# EasyEDA Pro project 一体板.epro, schematic Schematic1
Create Date: 2023-07-03; Page Name: P1; Project Name: 独轮车七月v2; Schematic Name: Schematic1; Update Date: 2023-07-09; Company: 嘉立创EDA; Page Size: A4; Version: V1.0
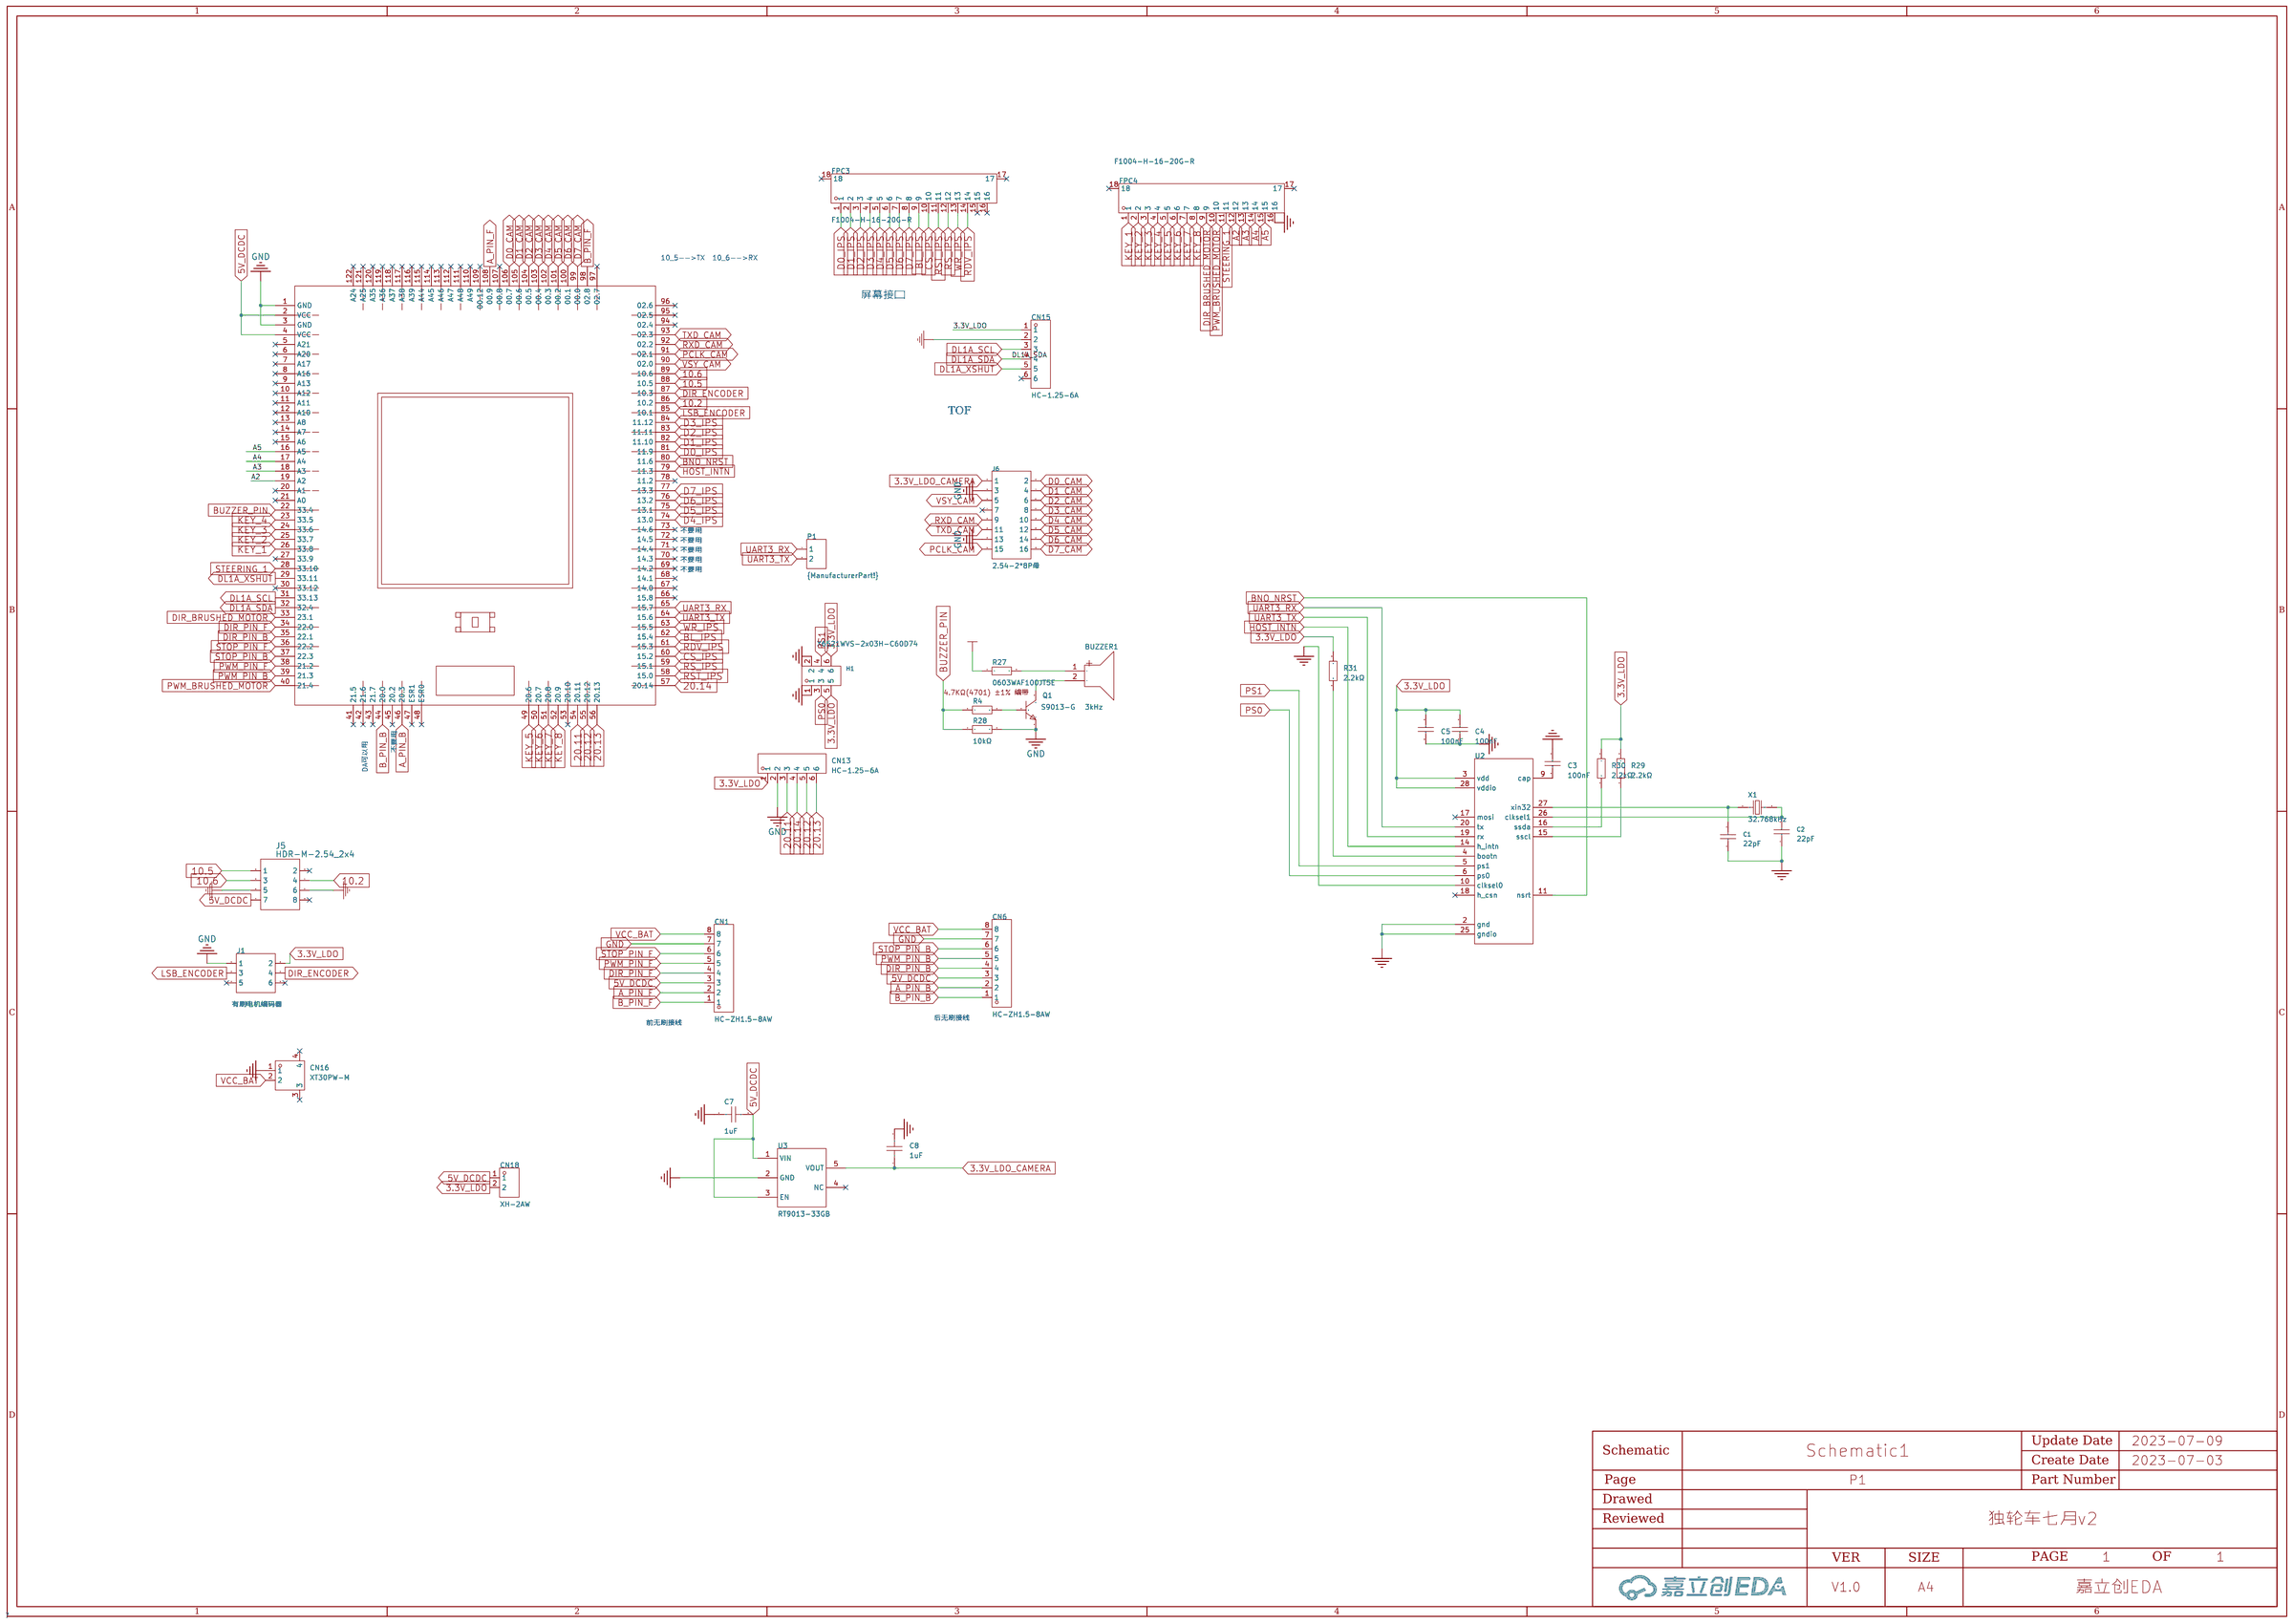
[diagram p0: schematic sheet]

## Parts
BUZZER1  3kHz  [BUZ-TH_BD9.0-P5.00-D0.6-FD]
C1  22pF  [C0402]
C2  22pF  [C0402]
C3  100nF  [C0603]
C4  100nF  [C0603]
C5  100nF  [C0603]
C7  1uF  [C0603]
C8  1uF  [C0603]
CN1  HC-ZH1.5-8AW  [CONN-TH_8P-P1.50_HCTL_HC-ZH1.5-8AW]
CN6  HC-ZH1.5-8AW  [CONN-TH_8P-P1.50_HCTL_HC-ZH1.5-8AW]
CN13  HC-1.25-6A  [CONN-TH_6P-P1.25_HCTL_HC-1.25-6A]
CN15  HC-1.25-6A  [CONN-TH_6P-P1.25_HCTL_HC-1.25-6A]
CN16  XT30PW-M  [CONN-TH_XT30PW-M]
CN18  XH-2AW  [CONN-TH_XH-2AW_C2908611]
FPC3  F1004-H-16-20G-R  [CONN-SMD_F1004-H-16-20G-R]
FPC4  F1004-H-16-20G-R  [CONN-SMD_F1004-H-16-20G-R]
H1  X6521WVS-2x03H-C60D74  [HDR-SMD_6P-P2.54-V-M-R2-C5-S7.4]
J1  有刷电机编码器  [HDR-TH_6P-P2.54-V-M-R2-C3-S2.54-1]
J5  HDR-M-2.54_2x4  [HDR-M-2.54_2X4]
J6  2.54-2*8P母  [HDR-TH_16P-P2.54-V-F-R2-C8-S2.54-1]
P1  -  [HDR-TH_2P-P2.54-V-F]
Q1  S9013-G  [SOT-23-3_L2.9-W1.3-P1.90-LS2.4-BR]
R4  0603WAF4701T5E  [R0603]
R27  0603WAF100JT5E  [R0603]
R28  10kΩ  [R0603]
R29  2.2kΩ  [R0603]
R30  2.2kΩ  [R0603]
R31  2.2kΩ  [R0603]
U1  TC387核心板 COPY  [TC264逐飞]
U2  -  [lga_28]
U3  RT9013-33GB  [SOT-23-5_L3.0-W1.7-P0.95-LS2.8-BL]
X1  32.768kHz  [FC-135R_L3.2-W1.5]

## Library data of the parts
BUZZER1 = HNB09A03: 驱动方式:电磁式;构造类型:有源;额定电压:3V;工作电压:1.5V~4.5V;消耗电流:30mA;频率:3kHz;声压(SPL):85dB@10cm;直径(φD):9mm;长度:-;宽度:-;高度:5.5mm;工作温度:-20~+70;; LCSC Part Name: 电磁式有源一体蜂鸣器HNB09A03; Supplier Part: C96102; Manufacturer: 华能; Supplier Footprint: 插件,P=5mm; JLCPCB Part Class: ExtendedPart; Datasheet: https://atta.szlcsc.com/upload/public/pdf/source/20170522/1495448326172.pdf; Supplier: LCSC; Oscillator Circuit: 电磁式; Technology Type: 有源; Rated Voltage: 3V; Operating Voltage: 1.5V~4.5V; Current Consumption: 30mA; Sound Pressure Level (SPL): 85dB@10cm; Diameter (φD): 9mm; Height: 5.5mm; Operating Temperature: -20~+70
C1 C2 = 0402CG220J500NT: 容值:22pF;精度:±5%;额定电压:50V;材质(温度系数):C0G;; LCSC Part Name: 22pF±5%50V; Supplier Part: C1555; Manufacturer: FH(风华); Supplier Footprint: 0402; JLCPCB Part Class: BasicPart; Datasheet: https://atta.szlcsc.com/upload/public/pdf/source/20200305/C486355_26A10D38EF8C2A5C37091D0039909270.pdf; Supplier: LCSC; Tolerance: ±5%; Voltage Rated: 50V; Temperature Coefficient: C0G
C3-C5 = 0603B104K500NT: 容值:100nF;精度:±10%;额定电压:50V;材质(温度系数):X7R;; LCSC Part Name: 100nF±10%50V; Supplier Part: C30926; Manufacturer: FH(风华); Supplier Footprint: 0603; JLCPCB Part Class: 扩展库; Datasheet: https://atta.szlcsc.com/upload/public/pdf/source/20170923/C30926_1506149436298988724.pdf; Supplier: LCSC; Tolerance: ±10%; Voltage Rated: 50V; Temperature Coefficient: X7R
C7 C8 = 0603B105K500NT: 温度系数:X7R;精度:±10%;额定电压:50V;容值:1uF;; LCSC Part Name: 1uF(105) ±10% 50V; Supplier Part: C90540; Manufacturer: FH(风华); Supplier Footprint: 0603; JLCPCB Part Class: Extended Part; Datasheet: https://atta.szlcsc.com/upload/public/pdf/source/20170923/C90540_1506149560830988967.pdf; Supplier: LCSC; Temperature Coefficient: X7R; Tolerance: ±10%; Voltage Rated: 50V
CN1 CN6 = HC-ZH1.5-8AW: 参考系列:ZH;间距:1.5mm;插针结构:1x8P;排数:1;每排PIN数:8;行距:-;公母:公型插针;安装方式:弯插;额定电流:1A;工作温度范围:-25~+85;; LCSC Part Name: 8P间距P=1.5mm; Supplier Part: C2845571; Manufacturer: HCTL(华灿天禄); Supplier Footprint: 插件,P=1.5mm; JLCPCB Part Class: ExtendedPart; Datasheet: https://atta.szlcsc.com/upload/public/pdf/source/20211122/624702E7E83328BF37B6C704FA01E49F.pdf; Supplier: LCSC; Reference Series: ZH; Pitch: 1.5mm; Pins Structure: 1x8P; Number of Rows: 1; Number of PINs Per Row: 8; Gender: 公型插针; Mounting Style: 弯插; Current Rating (Max): 1A; Operating Temperature Range: -25~+85
CN13 CN15 = HC-1.25-6A: 参考系列:-;间距:1.25mm;插针结构:1x6P;排数:1;每排PIN数:6;行距:-;公母:公型插针;安装方式:直插;额定电流:1A;工作温度范围:-25℃~+85℃;; LCSC Part Name: 1.25mm1x6P直插; Supplier Part: C2845524; Manufacturer: HCTL(华灿天禄); Supplier Footprint: 插件,P=1.25mm; JLCPCB Part Class: ExtendedPart; Datasheet: https://atta.szlcsc.com/upload/public/pdf/source/20210729/C2845520_89EAA22C8D4DE2FB8A253230326912FB.pdf; Supplier: LCSC; Pitch: 1.25mm; Pins Structure: 1x6P; Number of Rows: 1; Number of PINs Per Row: 6; Gender: 公型插针; Mounting Style: 直插; Current Rating (Max): 1A; Operating Temperature Range: -25℃~+85℃
CN16 = XT30PW-M: Socket,DCsupply,XT30,male,PIN:2; LCSC Part Name: AMASS(艾迈斯)航模插头卧式弯脚XT30PW-M公头; Supplier Part: C431092; Manufacturer: AMASS(艾迈斯); JLCPCB Part Class: ExtendedPart; Datasheet: https://atta.szlcsc.com/upload/public/pdf/source/20220222/6A9F22F7850E25B33E1BE430ADF8560B.pdf; Supplier: LCSC
CN18 = XH-2AW_C2908611: 参考系列:XH;间距:2.54mm;插针结构:1x2P;排数:1;每排PIN数:2;行距:-;公母:公型插针;安装方式:弯插;额定电流:3A;工作温度范围:-25℃~+85℃;; LCSC Part Name: XH2.54mm1x2P弯插; Supplier Part: C2908611; Manufacturer: HCTL(华灿天禄); Supplier Footprint: 弯插,P=2.54mm; JLCPCB Part Class: ExtendedPart; Datasheet: https://atta.szlcsc.com/upload/public/pdf/source/20211021/ACA2D54D99493880102FCACAC8DAABA8.pdf; Supplier: LCSC; Reference Series: XH; Pitch: 2.54mm; Pins Structure: 1x2P; Number of Rows: 1; Number of PINs Per Row: 2; Gender: 公型插针; Mounting Style: 弯插; Current Rating (Max): 3A; Operating Temperature Range: -25℃~+85℃
FPC3 FPC4 = F1004-H-16-20G-R: 间距:1mm;触点数量:16P;锁定特性:翻盖式;安装类型:卧贴;触点类型:双侧触点/上下接;; LCSC Part Name: 1mmP数:16P翻盖式双侧触点/上下接; Supplier Part: C668118; Manufacturer: XFCN(兴飞); Supplier Footprint: SMD,P=1mm; JLCPCB Part Class: ExtendedPart; Datasheet: https://atta.szlcsc.com/upload/public/pdf/source/20200618/C668118_823AC902B97FF0E52163AB5BF80076C2.pdf; Supplier: LCSC; Pitch: 1mm; Number of Contacts: 16P; Locking Feature: 翻盖式; Mounting Type: 卧贴; Contact Type: 双侧触点/上下接; Height Above Board: 2mm; FFC, FCB Thickness: 0.3mm
H1 = X6521WVS-2x03H-C60D74: 排数:双排;总PIN位数:6P;间距:2.54mm;插针结构:2x3P;行距:2.54mm;安装类型:立贴;圆针/方针:方针;额定电流:3A;额定电压:250V;配合针长度:6mm;塑高:2.5mm;端接针长度:-;触头材质:黄铜;触头镀层:金;工作温度范围:-40℃~+105℃;焊接温度(最大值):260℃;颜色:黑色;; LCSC Part Name: 2.54mm 2x3P 立贴 方针; Supplier Part: C780054; Manufacturer: XKB Connectivity(中国星坤); Supplier Footprint: SMD,P=2.54mm; JLCPCB Part Class: Extended Part; Datasheet: https://atta.szlcsc.com/upload/public/pdf/source/20211009/E3239EE5247E6BAFECB8B74A4FCF9AB8.pdf; Supplier: LCSC; Number of Rows: 双排; Number of Pins: 6P; Pitch: 2.54mm; Pin Structure: 2x3P; Row Spacing: 2.54mm; Mounting Type: 立贴; Circluar Pins/Square Pins: 方针; Current Rating (Max): 3A; Voltage Rating (Max): 250V; Length of Mating Pin: 6mm; Insulation Height: 2.5mm; Contact Material: 黄铜; Contact Plating: 金; Operating Temperature Range: -40℃~+105℃; Welding Temperature (Max): 260℃; Color: 黑色
J1 = 2.54-2*3P针: 间距:2.54mm;总PIN位数:6;排数:2;插针结构:-;行距:-;安装类型:直插;圆针/方针:-;额定电流:-;额定电压:-;配合针长度:-;塑高:-;触头材质:-;触头镀层:-;颜色:黑色;; LCSC Part Name: 2.54mm直插; Supplier Part: C65114; Manufacturer: BOOMELE(博穆精密); Supplier Footprint: 直插,P=2.54mm; JLCPCB Part Class: ExtendedPart; Datasheet: https://atta.szlcsc.comnull; Supplier: LCSC; Pitch: 2.54mm; Number of Pins: 6; Number of Rows: 2; Mounting Type: 直插; Color: 黑色
J5 = HDR-M-2.54_2x4: Supplier Part: C58363; Supplier: LCSC
J6 = 2.54-2*8P母: 排数:双排;总孔位数:16;间距:2.54mm;插孔结构:2x8P;行距:2.54mm;安装类型:直插;塑高:-;触头材质:黄铜;触头镀层:-;; LCSC Part Name: 2.54mm2x8P; Supplier Part: C30734; Manufacturer: BOOMELE(博穆精密); Supplier Footprint: 插件,P=2.54mm; JLCPCB Part Class: ExtendedPart; Supplier: LCSC; Number of Rows: 双排; Number of Holes: 16; Pitch: 2.54mm; Holes Structure: 2x8P; Row Spacing: 2.54mm; Mounting Type: 直插; Contact Material: 黄铜
P1 = 2.54-1*2P母: 间距:2.54mm;总孔位数:2;排数:1;插孔结构:1x2P;行距:-;安装类型:直插;塑高:-;触头材质:-;触头镀层:-;; LCSC Part Name: 2.54mm1x2P; Supplier Part: C49661; Manufacturer: BOOMELE(博穆精密); Supplier Footprint: 直插,P=2.54mm; JLCPCB Part Class: ExtendedPart; Datasheet: https://atta.szlcsc.com/upload/public/pdf/source/20151109/1457707570988.pdf; Supplier: LCSC; Pitch: 2.54mm; Number of Holes: 2; Number of Rows: 1; Holes Structure: 1x2P; Mounting Type: 直插
Q1 = S9013-G: 晶体管类型:NPN;集射极击穿电压(Vceo):25V;集电极电流(Ic):500mA;功率(Pd):300mW;; LCSC Part Name: S9013H档(200-350)H档(200-350); Supplier Part: C164888; Manufacturer: CJ(江苏长电/长晶); Supplier Footprint: SOT-23(SOT-23-3); JLCPCB Part Class: ExtendedPart; Datasheet: https://atta.szlcsc.com/upload/public/pdf/source/20171228/C164888_15144412896081213891.pdf; Supplier: LCSC; Transistor Type: NPN; Collector-Emitter Breakdown Voltage (Vceo): 25V; Collector Current (Ic): 500mA; Power Dissipation (Pd): 300mW
R4 = 0603WAF4701T5E: LCSC Part Name: 4.7KΩ(4701) ±1% 编带; Supplier Part: C23162; Manufacturer: UNI-ROYAL(厚声); Supplier Footprint: 0603; JLCPCB Part Class: BasicPart; Datasheet: https://atta.szlcsc.com/upload/public/pdf/source/20170920/C23162_1505901109673982545.pdf; Supplier: LCSC
R27 = 0603WAF100JT5E: LCSC Part Name: 10Ω(10R0)±1%编带; Supplier Part: C22859; Manufacturer: UNI-ROYAL(厚声); Supplier Footprint: 0603; JLCPCB Part Class: BasicPart; Datasheet: https://atta.szlcsc.com/upload/public/pdf/source/20170920/C22859_1505900954295982249.pdf; Supplier: LCSC
R28 = 0603WAF1002T5E: 电阻类型:厚膜电阻;阻值:10kΩ;精度:±1%;功率:100mW;温度系数:±100ppm/;最大工作电压:75V;工作温度范围:-55~+155;; LCSC Part Name: 10kΩ±1%100mW; Supplier Part: C25804; Manufacturer: UNI-ROYAL(厚声); Supplier Footprint: 0603; JLCPCB Part Class: BasicPart; Datasheet: https://atta.szlcsc.com/upload/public/pdf/source/20200306/C422600_1E6D84923E4A46A82E41ADD87F860B5C.pdf; Supplier: LCSC; Type: 厚膜电阻; Tolerance: ±1%; Power(Watts): 100mW; Temperature Coefficient: ±100ppm/; Overload Voltage (Max): 75V; Operating Temperature Range: -55~+155
R29-R31 = 0603WAF2201T5E: 电阻类型:厚膜电阻;阻值:2.2kΩ;精度:±1%;功率:100mW;; LCSC Part Name: 2.2kΩ±1%100mW; Supplier Part: C4190; Manufacturer: UNI-ROYAL(厚声); Supplier Footprint: 0603; JLCPCB Part Class: BasicPart; Datasheet: https://atta.szlcsc.com/upload/public/pdf/source/20200306/C422600_1E6D84923E4A46A82E41ADD87F860B5C.pdf; Supplier: LCSC; Type: 厚膜电阻; Tolerance: ±1%; Power(Watts): 100mW; Temperature Coefficient: ±100ppm/℃; Overload Voltage (Max): 75V; Operating Temperature Range: -55℃~+155℃
U1 = TC264核心板 COPY: Supplier: 逐飞
U2 = bno085: Supplier Part: C5189642
U3 = RT9013-33GB: 输出类型:固定;输出极性:正;最大输入电压:5.5V;输出电压:3.3V;输出电流:500mA;电源纹波抑制比(PSRR):50dB@(10kHz);; Supplier Part: C47773; Manufacturer: RICHTEK(立锜); Supplier Footprint: SOT-23-5; JLCPCB Part Class: Extended Part; Datasheet: https://atta.szlcsc.com/upload/public/pdf/source/20150504/1457707282459.pdf; Supplier: LCSC; Output Type: 固定; Output Polarity: 正; Number of Outputs: 1; Maximum Input Voltage: 5.5V; Output Voltage: 3.3V; Dropout Voltage: 400mV@(500mA); Output Current: 500mA; Power Supply Rejection Ratio (PSRR): 50dB@(10kHz)
X1 = Q13FC1350000400: 频率:32.768kHz;频率公差:±20ppm;负载电容:12.5pF;; LCSC Part Name: 32.768kHz±20ppm12.5pF; Supplier Part: C32346; Manufacturer: EPSON(爱普生); Supplier Footprint: SMD3215-2P; JLCPCB Part Class: BasicPart; Datasheet: https://atta.szlcsc.com/upload/public/pdf/source/20190108/C32346_746D6B07EAF90824457A96480007685F.pdf; Supplier: LCSC; Crystal Type: 贴片无源晶振; Frequency Tolerance: ±20ppm; Load Capacitance: 12.5pF; Equivalent Series Resistance (ESR): 70kΩ; Operating Temperature: -40℃~+85℃

## Nets
3.3V_LDO: C4.1 C5.1 CN13.1 CN15.1 CN18.2 H1.5 H1.6 J1.2 R27.1 R29.2 R30.2 R31.2 U2.3(vdd) U2.28(vddio)
3.3V_LDO_CAMERA: C8.1 J6.1 U3.5(VOUT)
5V_DCDC: C7.2 CN1.3 CN6.3 CN18.1 J5.7 U1.2(VCC) U1.4(VCC) U3.1(VIN) U3.3(EN)
GND: C1.1 C2.1 C3.1 C4.2 C5.2 C7.1 C8.2 CN1.7 CN6.7 CN13.2 CN15.2 CN16.1 FPC4.16 H1.1 H1.2 J1.1 J5.5 J5.6 J6.3 J6.13 Q1.2(E) R28.2 U1.1(GND) U1.3(GND) U2.2(gnd) U2.10(clksel0) U2.25(gndio) U3.2(GND)
VCC_BAT: CN1.8 CN6.8 CN16.2
10.2: J5.4 U1.86(10.2)
10.5: J5.1 U1.88(10.5)
10.6: J5.3 U1.89(10.6)
20.11: CN13.3 U1.54(20.11)
20.12: CN13.5 U1.55(20.12)
20.13: CN13.6 U1.56(20.13)
20.14: CN13.4 U1.57(20.14)
A2: FPC4.12 U1.19(A2)
A3: FPC4.13 U1.18(A3)
A4: FPC4.14 U1.17(A4)
A5: FPC4.15 U1.16(A5)
A_PIN_B: CN6.2 U1.46(20.3)
A_PIN_F: CN1.2 U1.108(00.9)
B_PIN_B: CN6.1 U1.44(20.0)
B_PIN_F: CN1.1 U1.98(02.8)
BL_IPS: FPC3.9 U1.62(15.4)
BNO_NRST: U1.80(11.6) U2.11(nsrt)
BUZZER_PIN: R4.1 R28.1 U1.22(33.4)
CS_IPS: FPC3.10 U1.60(15.2)
D0_CAM: J6.2 U1.106(00.7)
D0_IPS: FPC3.1 U1.81(11.9)
D1_CAM: J6.4 U1.105(00.6)
D1_IPS: FPC3.2 U1.82(11.10)
D2_CAM: J6.6 U1.104(00.5)
D2_IPS: FPC3.3 U1.83(11.11)
D3_CAM: J6.8 U1.103(00.4)
D3_IPS: FPC3.4 U1.84(11.12)
D4_CAM: J6.10 U1.102(00.3)
D4_IPS: FPC3.5 U1.74(13.0)
D5_CAM: J6.12 U1.101(00.2)
D5_IPS: FPC3.6 U1.75(13.1)
D6_CAM: J6.14 U1.100(00.1)
D6_IPS: FPC3.7 U1.76(13.2)
D7_CAM: J6.16 U1.99(00.0)
D7_IPS: FPC3.8 U1.77(13.3)
DIR_BRUSHED_MOTOR: FPC4.9 U1.33(23.1)
DIR_ENCODER: J1.4 U1.87(10.3)
DIR_PIN_B: CN6.4 U1.35(22.1)
DIR_PIN_F: CN1.4 U1.34(22.0)
DL1A_SCL: CN15.3 U1.31(33.13)
DL1A_SDA: CN15.4 U1.32(32.4)
DL1A_XSHUT: CN15.5 U1.29(33.11)
HOST_INTN: U1.79(11.3) U2.14(h_intn)
KEY_1: FPC4.1 U1.26(33.8)
KEY_2: FPC4.2 U1.25(33.7)
KEY_3: FPC4.3 U1.24(33.6)
KEY_4: FPC4.4 U1.23(33.5)
KEY_5: FPC4.5 U1.49(20.6)
KEY_6: FPC4.6 U1.50(20.7)
KEY_7: FPC4.7 U1.51(20.8)
KEY_8: FPC4.8 U1.52(20.9)
LSB_ENCODER: J1.3 U1.85(10.1)
PCLK_CAM: J6.15 U1.91(02.1)
PS0: H1.3 U2.6(ps0)
PS1: H1.4 U2.5(ps1)
PWM_BRUSHED_MOTOR: FPC4.10 U1.40(21.4)
PWM_PIN_B: CN6.5 U1.39(21.3)
PWM_PIN_F: CN1.5 U1.38(21.2)
RDV_IPS: FPC3.14 U1.61(15.3)
RS_IPS: FPC3.12 U1.59(15.1)
RST_IPS: FPC3.11 U1.58(15.0)
RXD_CAM: J6.9 U1.92(02.2)
STEERING_1: FPC4.11 U1.28(33.10)
STOP_PIN_B: CN6.6 U1.37(22.3)
STOP_PIN_F: CN1.6 U1.36(22.2)
TXD_CAM: J6.11 U1.93(02.3)
UART3_RX: P1.1 U1.65(15.7) U2.20(tx)
UART3_TX: P1.2 U1.64(15.6) U2.19(rx)
VSY_CAM: J6.5 U1.90(02.0)
WR_IPS: FPC3.13 U1.63(15.5)
$1N3896: Q1.1(B) R4.2
$1N3898: BUZZER1.1(+) R27.2
$1N3899: BUZZER1.2(-) Q1.3(C)
$1N12778: C2.2 U2.26(clksel1) X1.2
$1N12786: C1.2 U2.27(xin32) X1.1
$1N12868: C3.2 U2.9(cap)
$1N13403: R29.1 U2.15(sscl)
$1N13442: R30.1 U2.16(ssda)
$1N13483: R31.1 U2.4(bootn)

Not connected (* = marked no-connect by the designer): CN15 6*; CN16 3* 4*; FPC3 15* 16* 17* 18*; FPC4 17* 18*; J1 5* 6*; J5 2* 8*; J6 7*; U1 5(A21)* 6(A20)* 7(A17)* 8(A16)* 9(A13)* 10(A12)* 11(A11)* 12(A10)* 13(A8)* 14(A7)* 15(A6)* 20(A1)* 21(A0)* 27(33.9)* 30(33.12)* 41(21.5)* 42(21.6)* 43(21.7)* 45(20.2)* 47(ESR1)* 48(ESR0)* 53(20.10)* 66(15.8)* 67(14.0)* 68(14.1)* 69(14.2)* 70(14.3)* 71(14.4)* 72(14.5)* 73(14.6)* 78(11.2)* 94(02.4)* 95(02.5)* 96(02.6)* 97(02.7)* 107(00.8)* 109(00.12)* 110(A49)* 111(A48)* 112(A47)* 113(A46)* 114(A45)* 115(A44)* 116(A39)* 117(A38)* 118(A37)* 119(A36)* 120(A35)* 121(A25)* 122(A24)*; U2 17(mosi)* 18(h_csn)*; U3 4(NC)*

## Notes on the sheet
- 10_5-->TX  10_6-->RX
- 屏幕接口
- TOF
- 不要用
- 不要用
- 不要用
- 不要用
- 不要用
- 不要用
- DA可以用
- 后无刷接线
- 前无刷接线
